# Altium schematic sheet Power_Supply.SchDoc
size Tabloid; SheetNumber: 3; SheetTotal: 4
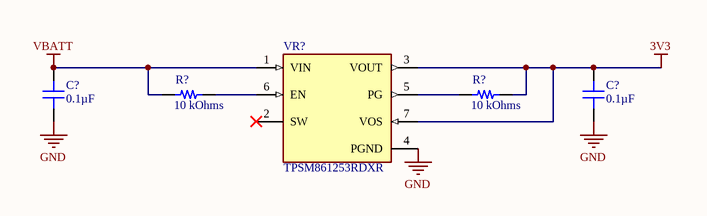
[diagram p0: Power_Supply.SchDoc]

## Parts
(Parts that share a designator on the sheet are numbered #1, #2 ... from top to bottom, then left to right.)
C?#1  0.1µF  [CAP 0603_1608]
C?#2  0.1µF  [CAP 0603_1608]
R?#1  10 kOhms  [RES 0603_1608]
R?#2  10 kOhms  [RES 0603_1608]
VR?  TPSM861253RDXR  [VREG_TPSM861253RDXR]

## Nets
3V3: C?#2.2 R?#2.2 VR?.3(VOUT) VR?.7(VOS)
GND: C?#1.1 C?#2.1 VR?.4(PGND)
VBATT: C?#1.2 R?#1.1 VR?.1(VIN)
NetR?#1_2: R?#1.2 VR?.6(EN)
NetR?#2_1: R?#2.1 VR?.5(PG)

Not connected (* = marked no-connect by the designer): VR? 2(SW)*

## Notes on the sheet
- Insert really cool logo here
- Really_Cool_Title:
- Revision:
- Desciption:
- Version:
- Engineer:

## Library data of the parts
C?#1 C?#2 = 06033G104MAT2A: CAP CER 0.1UF 25V Y5V 0603; manufacturer: AVX Corporation; Temperature Coefficient: Y5V (F); Tolerance: ±20%; Part Number: 06033G104MAT2A; Value: 0.1µF; Applications: General Purpose; Capacitance: 0.1µF; componentlink1description: Datasheet; componentlink1url: http://datasheets.avx.com/Y5V.pdf; componentlink2description: DigiKey Link; componentlink2url: http://digikey.com/product-detail/en/avx-corporation/06033G104MAT2A/478-11369-1-ND/8019122; Device Package: 0603 (1608 Metric); lastupdated: 9/2/2020 1:03:16 AM; Lifecycle Status: Active; Minimum Order: 1; Mounting Type: Surface Mount, MLCC; Operating Temperature: -30°C ~ 85°C; Package / Case: 0603 (1608 Metric); packaging: TapeAndReel; partid: 13439; Part Status: Active; price: 0.02; series: -; Size / Dimension: 0.063" L x 0.032" W (1.60mm x 0.81mm); Supplier 1: DigiKey; Supplier Part Number 1: 478-11369-1-ND; Thickness (Max): 0.035" (0.90mm); Voltage - Rated: 25V
R?#1 R?#2 = CRCW060310K0JNEA: RES SMD 10K OHM 5% 1/10W 0603; Manufacturer: Vishay Dale; Power (Watts): 0.1W, 1/10W; Temperature Coefficient: ±200ppm/°C; Part Number: CRCW060310K0JNEA; Value: 10 kOhms; ComponentLink1Description: Datasheet; ComponentLink1URL: http://www.vishay.com/docs/20035/dcrcwe3.pdf; ComponentLink2Description: DigiKey Link; ComponentLink2URL: https://www.digikey.com/en/products/detail/vishay-dale/CRCW060310K0JNEA/1174253; Composition: Thick Film; Device Package: 0603 (1608 Metric); Features: Automotive AEC-Q200; Height - Seated (Max): 0.020" (0.50mm); LastUpdated: 2/9/2024 8:43:35 PM; Lifecycle Status: Active; Minimum Order: 1; Number of Terminations: 2; Operating Temperature: -55°C ~ 155°C; Package / Case: 0603 (1608 Metric); Packaging: CutTape; PartId: 5216; Part Status: Active; Price: 0.01; Ratings: AEC-Q200; Resistance: 10 kOhms; Series: CRCW; Size / Dimension: 0.063" L x 0.033" W (1.60mm x 0.85mm); Supplier 1: DigiKey; Supplier Part Number 1: 541-10KGCT-ND; Supplier Device Package: 0603; Tolerance: ±5%
VR? = TPSM861253RDXR: 3V to 17V input voltage, 3.3V, 1A output synchronous buck module in QFN package; MF: Texas Instruments; SnapEDA_Link: https://www.snapeda.com/parts/TPSM861253RDXR/Texas+Instruments/view-part/?ref=snap; Package: PowerFQFN-7 Texas Instruments; Value: *; MP: TPSM861253RDXR; Check_prices: https://www.snapeda.com/parts/TPSM861253RDXR/Texas+Instruments/view-part/?ref=eda